# EAGLE design charge controller_mk2 (EAGLE 9.3.2)
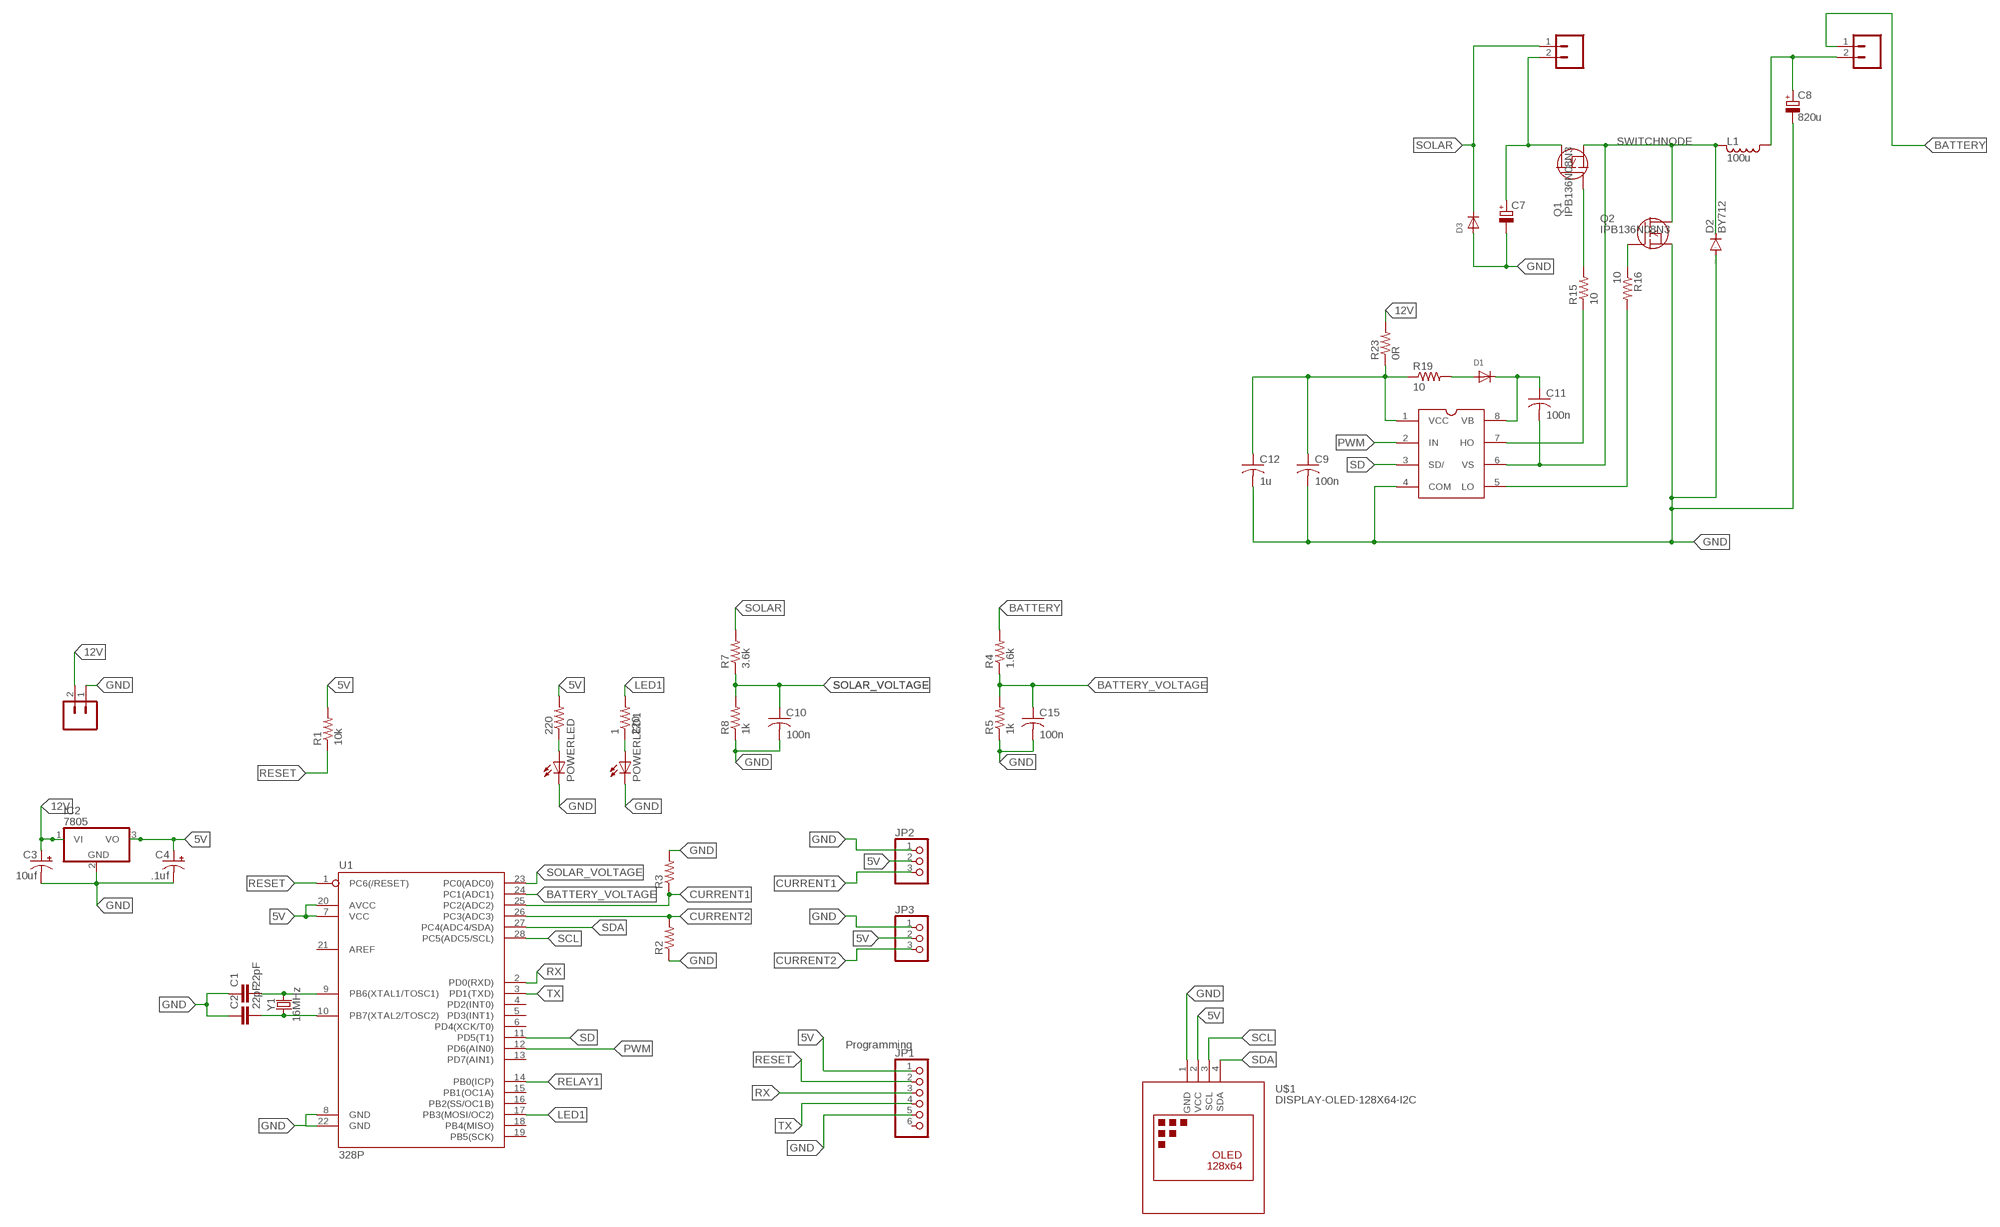
[diagram p0: schematic, sheet 1]

## Parts
1  220  R-US_0204/5  [0204/5]
220  R-US_0204/5  [0204/5]
BATTERY-OUT  CONN_025MM  [SCREWTERMINAL-5MM-2]
C1  22pF  22PF-PTH-2.54MM-200V-5%  [CAP-PTH-2.54]
C2  22pF  22PF-PTH-2.54MM-200V-5%  [CAP-PTH-2.54]
C3  10uf  CPOL-USE5-5  [E5-5]
C4  .1uf  CPOL-USE5-5  [E5-5]
C7  680u  C_POLARIZED10MM  [10MM]
C8  820u  C_POLARIZED10MM  [10MM]
C9  100n  C-US050-025X075  [C050-025X075]
C10  100n  C-US050-025X075  [C050-025X075]
C11  100n  C-US050-055X075  [C050-055X075]
C12  1u  C-US050-025X075  [C050-025X075]
C15  100n  C-US050-025X075  [C050-025X075]
D1  DIODEDO-1N4148  [DO-1N4148]
D2  BY712  [SOD61E]
D3  DIODEDO-1N4148  [DO-1N4148]
IC2  7805  7818TV  [TO220V]
J1  PWR_in  CONN_025MM  [SCREWTERMINAL-5MM-2]
JP1  PINHD-1X6  [1X06]
JP2  PINHD-1X3  [1X03]
JP3  PINHD-1X3  [1X03]
L1  100u  INDUCTORMSS1583  [MSS1583]
POWERLED  LED5MM  [LED5MM]
POWERLED1  LED5MM  [LED5MM]
Q1  IPB136N08N3  IRF840  [TO220]
Q2  IPB136N08N3  IRF840  [TO220]
R1  10k  R-US_0204/5  [0204/5]
R2  R-US_0207/7  [0207/7]
R3  R-US_0207/7  [0207/7]
R4  1.6k  R-US_0207/7  [0207/7]
R5  1k  R-US_0207/7  [0207/7]
R7  3.6k  R-US_0207/7  [0207/7]
R8  1k  R-US_0207/7  [0207/7]
R15  10  R-US_0204/7  [0204/7]
R16  10  R-US_0204/7  [0204/7]
R19  10  R-US_0204/7  [0204/7]
R23  0R  R-US_0204/7  [0204/7]
SOLAR-IN  CONN_025MM  [SCREWTERMINAL-5MM-2]
U1  328P  ATMEGA328P_PDIP  [DIP28]
U$1  DISPLAY-OLED-128X64-I2C  [DISPLAY-OLED-128X64-I2C]
U$2  IR2104  [IR2104]
Y1  16MHz  CRYSTAL-16MHZPTH-HC49US  [HC49US]

## Nets
5V: 220.2 C4.+ IC2.3(VO) JP1.1 JP2.2 JP3.2 R1.2 U1.7(VCC) U1.20(AVCC) U$1.2(VCC)
12V: C3.+ IC2.1(VI) J1.2 R23.2
BATTERY: BATTERY-OUT.1 R4.2
BATTERY_VOLTAGE: C15.1 R4.1 R5.2 U1.24(PC1(ADC1))
CURRENT1: JP2.3 R3.1 U1.25(PC2(ADC2))
CURRENT2: JP3.3 R2.2 U1.26(PC3(ADC3))
GND: C1.1 C2.1 C3.- C4.- C7.- C8.- C9.2 C10.2 C12.2 C15.2 D2.A D3.A IC2.2(GND) J1.1 JP1.5 JP2.1 JP3.1 POWERLED1.K(C) POWERLED.K(C) Q2.3(S) R2.1 R3.2 R5.1 R8.1 U1.8(GND) U1.22(GND) U$1.1(GND) U$2.4(COM)
LED1: 1.2 U1.17(PB3(MOSI/OC2))
N$1: 220.1 POWERLED.A
N$2: C1.2 U1.9(PB6(XTAL1/TOSC1)) Y1.2
N$3: C2.2 U1.10(PB7(XTAL2/TOSC2)) Y1.1
N$4: D1.A R19.2
N$5: 1.1 POWERLED1.A
N$7: BATTERY-OUT.2 C8.+ L1.1
N$8: Q1.1(G) R15.2
N$9: C7.+ Q1.2(D) SOLAR-IN.2
N$11: Q2.1(G) R16.1
N$12: C11.1 D1.C U$2.8(VB)
N$14: R15.1 U$2.7(HO)
N$15: R16.2 U$2.5(LO)
N$19: C9.1 C12.1 R19.1 R23.1 U$2.1(VCC)
PWM: U1.12(PD6(AIN0)) U$2.2(IN)
RELAY1: U1.14(PB0(ICP))
RESET: JP1.2 R1.1 U1.1(PC6(/RESET))
RX: JP1.3 U1.2(PD0(RXD))
SCL: U1.28(PC5(ADC5/SCL)) U$1.3(SCL)
SD: U1.11(PD5(T1)) U$2.3(SD/)
SDA: U1.27(PC4(ADC4/SDA)) U$1.4(SDA)
SOLAR: D3.C R7.2 SOLAR-IN.1
SOLAR_VOLTAGE: C10.1 R7.1 R8.2 U1.23(PC0(ADC0))
SWITCHNODE: C11.2 D2.C L1.2 Q1.3(S) Q2.2(D) U$2.6(VS)
TX: JP1.4 U1.3(PD1(TXD))
Unconnected: JP1.6 U1.4(PD2(INT0)) U1.5(PD3(INT1)) U1.6(PD4(XCK/T0)) U1.13(PD7(AIN1)) U1.15(PB1(OC1A)) U1.16(PB2(SS/OC1B)) U1.18(PB4(MISO)) U1.19(PB5(SCK)) U1.21(AREF)

## Notes on the sheet
- Programming

## Library data of the parts
1 220 R1-R5 R7 R8 R15 R16 R19 R23 = adafruit:R-US_: RESISTOR, American symbol
BATTERY-OUT J1 SOLAR-IN = SparkFun-Retired:CONN_02: Multi connection point. Often used as Generic Header-pin footprint for 0.1 inch spaced/style header connections On any of the 0.1 inch spaced packages, you can populate with these: Break Away Headers - Straight <https://www.sparkfun.com/products/116> (PRT-00116) Break Away Male Headers - Right Angle <https://www.sparkfun.com/products/553> (PRT-00553) Female Headers <https://www.sparkfun.com/products/115> (PRT-00115) Break Away Headers - Machine Pin <https://www.sparkfun.com/products/117> (PRT-00117) Break Away Female Headers - Swiss Machine Pin <https://www.sparkfun.com/products/743> (PRT-00743) For SCREWTERMINALS and SPRING TERMINALS visit here: Screw Terimnals on SparkFun.com <https://www.sparkfun.com/search/results?term=Screw+Terminals> (5mm/3.5mm/2.54mm spacing) This device is also useful as a general connection point to wire up your design to another part of your project. Our various solder wires solder well into these plated through hole pads. Hook-Up Wire - Assortment (Stranded, 22 AWG) <https://www.sparkfun.com/products/11375> (PRT-11375) Hook-Up Wire - Assortment (Solid Core, 22 AWG) <https://www.sparkfun.com/products/11367> (PRT-11367) View the entire wire category on our website here <https://www.sparkfun.com/categories/141> Special notes: Molex polarized connector foot print use with: PRT-08233 with associated crimp pins and housings. 2.54_SCREWTERM for use with PRT-10571. 3.5mm Screw Terminal footprints for PRT-08084 5mm Screw Terminal footprints for use with PRT-08432; SF_SKU: PRT-08432
C1 C2 = SparkFun-Capacitors:22PF: 22pF ceramic capacitors A capacitor is a passive two-terminal electrical component used to store electrical energy temporarily in an electric field.; PROD_ID: CAP-09128
C3 C4 = adafruit:CPOL-US: POLARIZED CAPACITOR, American symbol
C7 C8 = 00Capacitor:C_POLARIZED
C9-C12 C15 = adafruit:C-US: CAPACITOR, American symbol
D1 D3 = adafruit:DIODE: Diode SMADIODE - SMA Surface Mount Package 20V 1A Schottky Diode Digikey: 641-1014-6-ND DO-1N4148 - Through Hole Small Current Diode SOD-123 20V 1 A (.5mV Vf) Schottky Diode - Digikey: MBRX120TPMSCT-ND SOD-323 10V 570mA (.38mV Vf, 3ns) Schottky Diode - Digikey: ZLLS410CT-ND SOD-523 30V 30mA Schottky Diode (RB751S-40TE61) - Digikey: RB751S-40TE61CT-ND SOT23-R/W - SOT23 Package (R = Solder Paste/Reflow Ovens, W = Hand-Soldering) BAT54Film 40V 300mA - Digikey: 497-7162-1-ND
D2 = diode:BY712: DIODE fast high-voltage soft-recovery rectifier
IC2 = linear:78*: Positive VOLTAGE REGULATOR Source: http://cache.national.com/ds/LM/LM78L05.pdf http://www.fairchildsemi.com/ds/LM/LM7805.pdf
JP1 = adafruit:PINHD-1X6: PIN HEADER
JP2 JP3 = adafruit:PINHD-1X3: PIN HEADER
L1 = 00Inductor:INDUCTOR
POWERLED POWERLED1 = adafruit:LED: LED OSRAM: - CHIPLED LG R971, LG N971, LY N971, LG Q971, LY Q971, LO R971, LY R971 LH N974, LH R974 LS Q976, LO Q976, LY Q976 LO Q996 - Hyper CHIPLED LW Q18S LB Q993, LB Q99A, LB R99A - SideLED LS A670, LO A670, LY A670, LG A670, LP A670 LB A673, LV A673, LT A673, LW A673 LH A674 LY A675 LS A676, LA A676, LO A676, LY A676, LW A676 LS A679, LY A679, LG A679 - Hyper Micro SIDELED® LS Y876, LA Y876, LO Y876, LY Y876 LT Y87S - SmartLED LW L88C, LW L88S LB L89C, LB L89S, LG L890 LS L89K, LO L89K, LY L89K LS L896, LA L896, LO L896, LY L896 - TOPLED LS T670, LO T670, LY T670, LG T670, LP T670 LSG T670, LSP T670, LSY T670, LOP T670, LYG T670 LG T671, LOG T671, LSG T671 LB T673, LV T673, LT T673, LW T673 LH T674 LS T676, LA T676, LO T676, LY T676, LB T676, LH T676, LSB T676, LW T676 LB T67C, LV T67C, LT T67C, LS T67K, LO T67K, LY T67K, LW E67C LS E67B, LA E67B, LO E67B, LY E67B, LB E67C, LV E67C, LT E67C LW T67C LS T679, LY T679, LG T679 LS T770, LO T770, LY T770, LG T770, LP T770 LB T773, LV T773, LT T773, LW T773 LH T774 LS E675, LA E675, LY E675, LS T675 LS T776, LA T776, LO T776, LY T776, LB T776 LHGB T686 LT T68C, LB T68C - Hyper Mini TOPLED® LB M676 - Mini TOPLED Santana® LG M470 LS M47K, LO M47K, LY M47K Source: http://www.osram.convergy.de/
Q1 Q2 = tango:IRF840: N-Channel Enhancement MOSFET (HEXFET); 500V; 8A; 0,85Ohm
U1 = SparkFun-IC-Microcontroller:ATMEGA328P_PDIP: Atmel 328P Through hole ATMEGA328P uC used in the Arduino 32kb flash, 1k EEPROM, 2k SRAM Datasheet <http://www.sparkfun.com/datasheets/Components/SMD/ATMega328.pdf> SparkFun Products Storefront component: AVR 28 Pin 20MHz 32K 6A/D - ATMega328P <https://www.sparkfun.com/products/9061> (COM-09061) SparkFun Simon Says - Through-Hole Soldering Kit <https://www.sparkfun.com/products/10547> (KIT-10547) SparkFun Learn to Solder - Simon Says <https://www.sparkfun.com/products/13708> (KIT-13708) SparkFun BigTime Watch Kit <https://www.sparkfun.com/products/11734> (KIT-11734) SparkFun ClockIt <https://www.sparkfun.com/products/10930> (KIT-10930) SparkFun Serial Enabled LCD Kit <https://www.sparkfun.com/products/10097> (LCD-10097) SparkFun Simon Tilts - Through Hole Soldering Kit <https://www.sparkfun.com/products/12634> (KIT-12634) SparkFun Frequency Counter Kit <https://www.sparkfun.com/products/10140> (KIT-10140) FabFM Radio Kit <https://www.sparkfun.com/products/11043> (KIT-11043) SparkFun Binary Blaster Kit <https://www.sparkfun.com/products/12037> (KIT-12037) SparkFun Metro-Gnome <https://www.sparkfun.com/products/9236> (KIT-09236) ATmega328 with Arduino Optiboot (Uno) <https://www.sparkfun.com/products/10524> (DEV-10524); PROD_ID: IC-09136
U$1 = diy-modules:DISPLAY-OLED-128X64-I2C: 128x64 Dot Matrix OLED Module based on SSD1306 chip Variant with I2C interface More details available here: http://www.instructables.com/id/Monochrome-096-i2c-OLED-display-with-arduino-SSD13/ SSD1306 datasheet: https://cdn-shop.adafruit.com/datasheets/SSD1306.pdf Click here to find device on ebay.com <http://www.ebay.com/sch/oled+display+128x64+iic> Note: There are two variants: I2C and SPI. Search for the proper version.
U$2 = ir-2104:IR2104: Half Bridge mosfet - IGBT driver
Y1 = SparkFun-Clocks:CRYSTAL-16MHZ: 16MHz Crystal Digikey Example <http://www.digikey.com/product-search/en?keywords=535-9122-1-ND> Frequency: 16MHz Frequency Stability: ±50ppm Frequency Tolerance: ±20ppm Load Capacitance: 18pF SparkFun Products: Pro Micro -5V/16MHz <https://www.sparkfun.com/products/12640> SparkFun Serial Enabled LCD Kit <https://www.sparkfun.com/products/10097>; PROD_ID: XTAL-08181; SF_ID: COM-00536

## Board
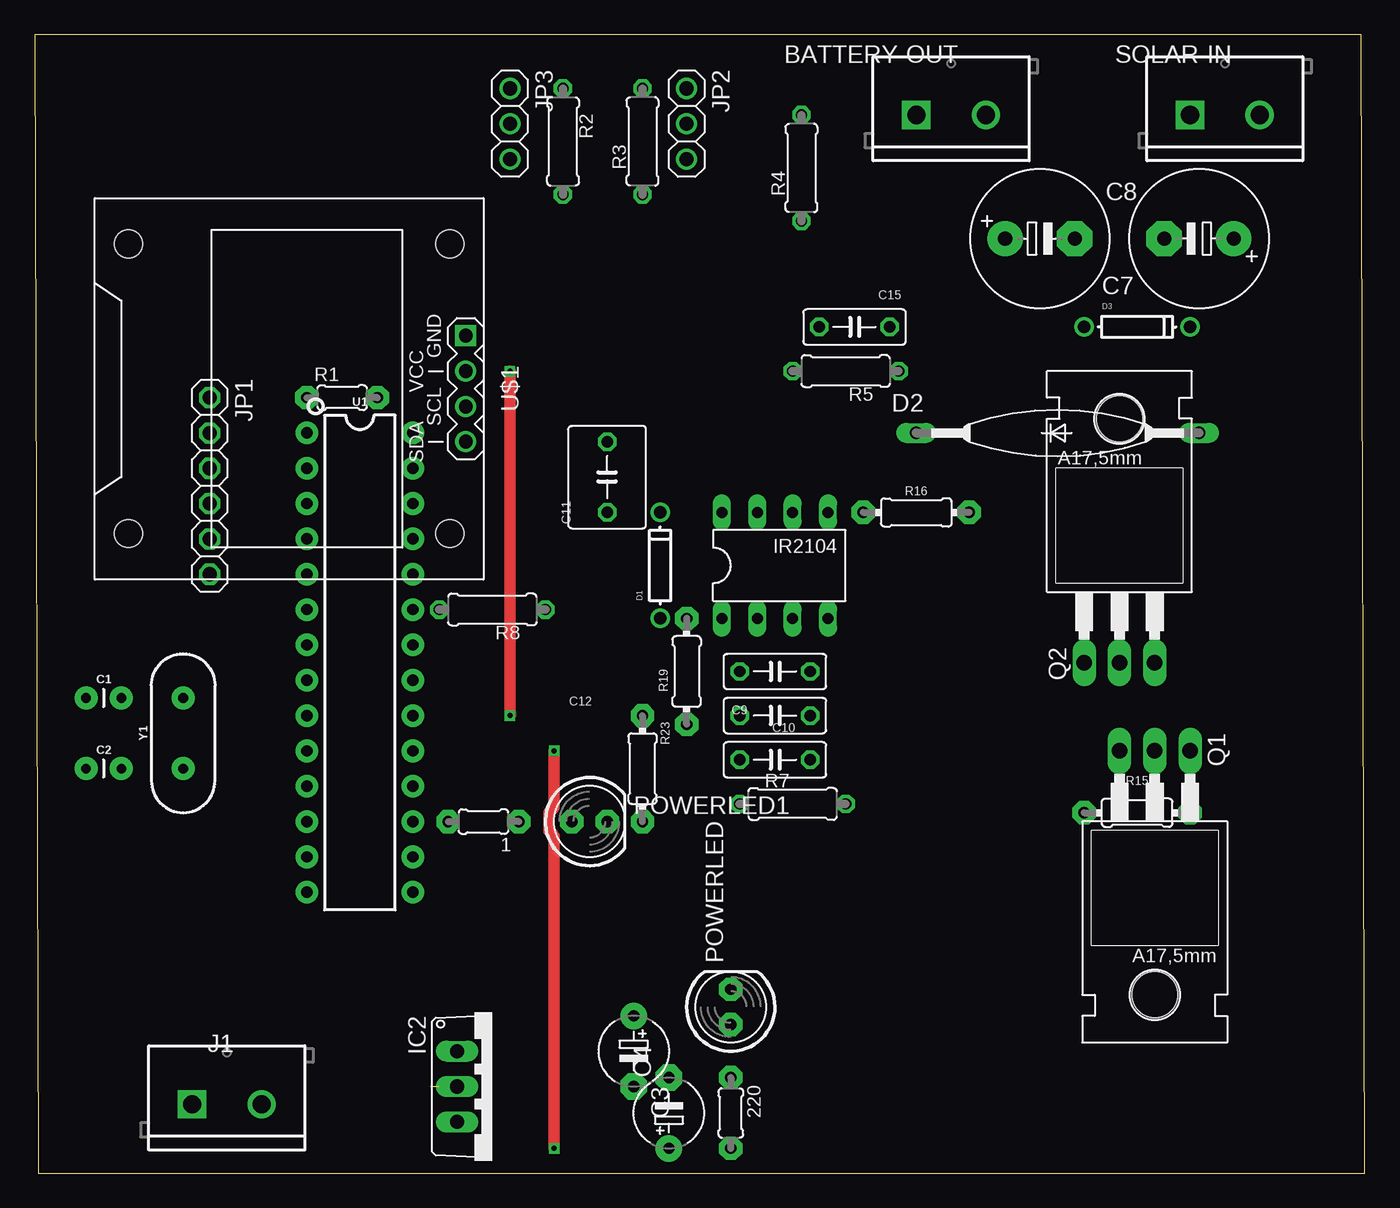
[diagram p1: board, top side]
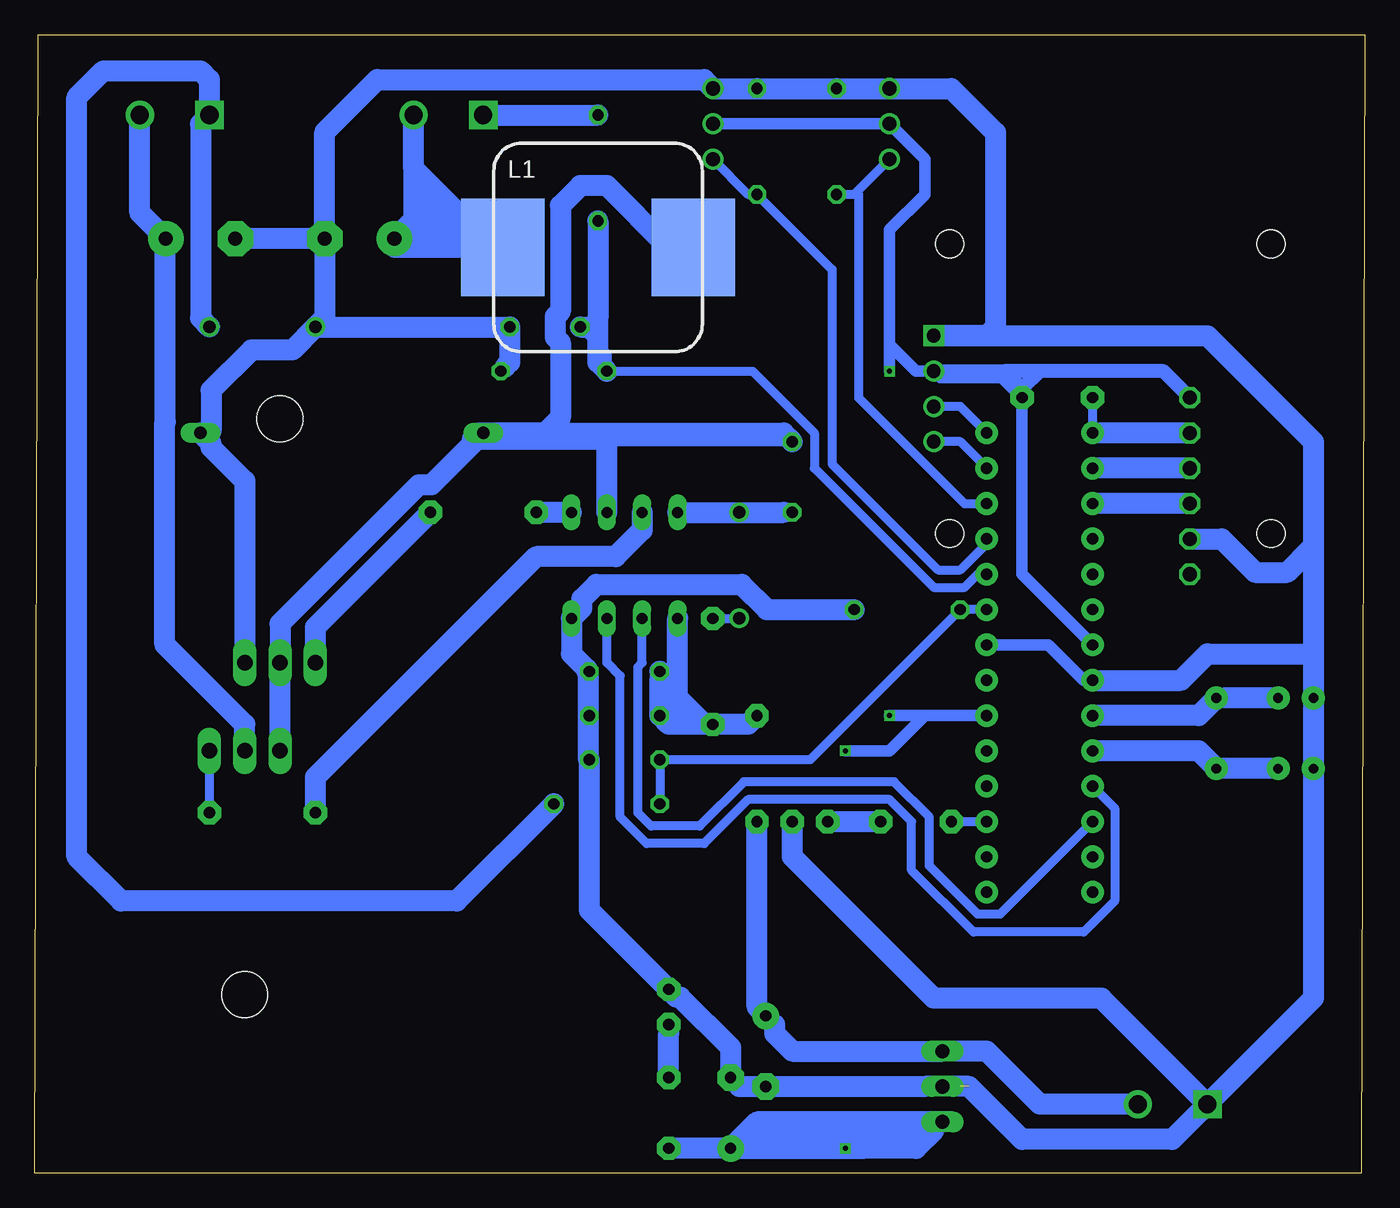
[diagram p2: board, bottom side, seen from below]

Size 95.61 x 81.84 mm. Coordinates in mm from the lower left corner, seen from the top.
Outline: 0.25,0 95.61,0 95.36,81.84 0,81.84 0.25,0
Copper layers (1*16): Top 0.035mm / dielectric 1.5mm / Bottom 0.035mm
Design rules "default *": minimum track width 25mil, minimum drill 0.35mm, track to track 15mil, track to pad 15mil, pad to pad 15mil, via to via 6mil, smd to smd 6mil, copper to edge 40mil, drill to drill 6mil, minimum pad ring 10mil, minimum via ring 8mil, stop-mask expansion 4mil, vias tented up to drill 0mil, thermal gap 10mil

### Footprints (pad centres in the part's own frame; a part is rotated, then mirrored left to right if it is on the bottom)
0204/5 = drill 0.813 pad 1.676 octagon: 1 -2.54,0; 2 2.54,0
SCREWTERMINAL-5MM-2 = drill 1.3 pad 2.032 square: 1 0,0 | drill 1.3 pad 2.032: 2 5,0
CAP-PTH-2.54 = drill 0.7 pad 1.651: 1 -1.27,0; 2 1.27,0
E5-5 = drill 0.813 pad 1.905: + -2.54,0 | drill 0.813 pad 1.905 octagon: - 2.54,0
10MM = drill 1.016 pad 2.54: + -2.5,0 | drill 1.016 pad 2.54 octagon: - 2.5,0
C050-025X075 = drill 0.813 octagon: 1 -2.54,0; 2 2.54,0
C050-055X075 = drill 0.813 octagon: 1 -2.54,0; 2 2.54,0
DO-1N4148 = drill 0.9: A -3.81,0; C 3.81,0
SOD61E = drill 0.914 long: A 10.16,0; C -10.16,0
TO220V = drill 1.016 long: 1 -2.54,-2.54; 2 0,-2.54; 3 2.54,-2.54
1X06 = drill 1.016 octagon: 1 -6.35,0; 2 -3.81,0; 3 -1.27,0; 4 1.27,0; 5 3.81,0; 6 6.35,0
1X03 = drill 1.016: 1 -2.54,0; 2 0,0; 3 2.54,0
MSS1583 = smd 6 x 7: 1 -6.85,0; 2 6.85,0
LED5MM = drill 0.813 pad 1.676 octagon: A -1.27,0; K 1.27,0
TO220 = drill 1.118 long: 1 -2.54,-6.35; 2 0,-6.35; 3 2.54,-6.35 | hole 3.302: 0,11.176
0207/7 = drill 0.813 octagon: 1 -3.81,0; 2 3.81,0
0204/7 = drill 0.813 pad 1.676 octagon: 1 -3.81,0; 2 3.81,0
DIP28 = drill 0.813 pad 1.626: 1 -16.51,-3.81; 2 -13.97,-3.81; 3 -11.43,-3.81; 4 -8.89,-3.81; 5 -6.35,-3.81; 6 -3.81,-3.81; 7 -1.27,-3.81; 8 1.27,-3.81; 9 3.81,-3.81; 10 6.35,-3.81; 11 8.89,-3.81; 12 11.43,-3.81; 13 13.97,-3.81; 14 16.51,-3.81; 15 16.51,3.81; 16 13.97,3.81; 17 11.43,3.81; 18 8.89,3.81; 19 6.35,3.81; 20 3.81,3.81; 21 1.27,3.81; 22 -1.27,3.81; 23 -3.81,3.81; 24 -6.35,3.81; 25 -8.89,3.81; 26 -11.43,3.81; 27 -13.97,3.81; 28 -16.51,3.81
DISPLAY-OLED-128X64-I2C = drill 1 square: 1 -3.81,12.7 | drill 1: 2 -1.27,12.7; 3 1.27,12.7; 4 3.81,12.7 | hole 2: -10.414,11.557; 10.414,11.557; 10.414,-11.557; -10.414,-11.557
IR2104 = drill 0.8 long: 1 -1.905,8.89; 2 -1.905,6.35; 3 -1.905,3.81; 4 -1.905,1.27; 5 5.715,1.27; 6 5.715,3.81; 7 5.715,6.35; 8 5.715,8.89
HC49US = drill 0.7 pad 1.651: 1 -2.54,0; 2 2.54,0

### Placement (x,y rotation side)
1  32.26,25.27 180 top
220  50.04,4.32 270 top
BATTERY-OUT  63.37,76.07 0 top
C1  4.95,34.16 0 top
C2  4.95,29.08 0 top
C3  43.05,8.76 270 top
C4  45.59,4.32 90 top
C7  83.69,67.18 180 top
C8  72.26,67.18 0 top
C9  53.21,32.89 0 top
C10  53.21,29.72 0 top
C11  41.15,50.04 90 top
C12  53.21,36.07 0 top
C15  58.93,60.83 0 top
D1  44.96,43.69 90 top
D2  73.53,53.21 0 top
D3  79.25,60.83 0 top
IC2  32.89,6.22 270 top
J1  11.3,4.95 0 top
JP1  12.57,49.4 270 top
JP2  46.86,75.44 270 top
JP3  34.16,75.44 270 top
L1  55.12,66.55 0 bottom
POWERLED  50.04,11.94 90 top
POWERLED1  39.88,25.27 0 top
Q1  80.52,24 180 top
Q2  77.98,43.05 0 top
R1  22.1,55.75 0 top
R2  37.97,74.17 270 top
R3  43.69,74.17 90 top
R4  55.12,72.26 90 top
R5  58.29,57.66 180 top
R7  54.48,26.54 0 top
R8  32.89,40.51 180 top
R15  79.25,25.91 0 top
R16  63.37,47.5 180 top
R19  46.86,36.07 90 top
R23  43.69,29.08 270 top
SOLAR-IN  83.06,76.07 0 top
U1  23.37,36.7 270 top
U$1  18.29,56.39 270 top
U$2  58.29,41.78 90 top
Y1  10.67,31.62 90 top

### Tracks (layer width: path | path; a pad name or v marks a point on that pad's centre or on a via)
5V  (via drill 0.35)
  Top 0.813: v37.34,1.78 37.34,24.24 36.98,24.6 36.98,25.95 37.34,26.3 v37.34,30.35 | v34.16,32.89 v34.16,57.66
  Bottom 0.635: 25.91,57.34 26.07,57.18 | 21.14,39.56 U1.7
  Bottom 0.813: JP2.2 JP3.2 31.62,72.9 31.62,70.36 34.16,67.82 34.16,59.56 | 34.16,59.56 32.26,57.66 U$1.2 30.51,57.18 26.07,57.18 R1.2 | R1.2 24.64,56.39 | R1.2 24.64,43.05 U1.7 | 37.34,3.68 37.34,3.05 | v37.34,30.35 34.16,30.35 31.62,32.89 | 31.62,32.89 U1.20 | 31.62,32.89 v34.16,32.89 | v34.16,57.66 34.16,59.56 | IC2.3 30.99,3.05 32.26,3.05 34.8,3.05 36.07,3.05 37.34,3.05 | 36.7,3.68 37.34,3.05 | 37.34,3.05 v37.34,1.78 36.39,2.73 | 38.61,3.05 39.24,3.05
  Bottom 1.016: U$1.2 25.91,57.66 | 25.91,57.66 24.64,56.39 23.37,57.66 | JP1.1 14.48,57.66 23.37,57.66 | 23.37,57.66 25.91,57.66
  Bottom 1.524: 44.32,3.05 43.69,3.68 37.34,3.68 36.7,3.68 IC2.3 34.16,3.68 34.8,3.05 | 44.32,3.05 C4.+ | C4.+ 220.2 | v37.34,1.78 38.61,3.05 44.32,3.05 | C4.+ 36.07,1.78 | 30.99,3.05 32.26,1.78 36.07,1.78 | 36.07,1.78 36.07,3.05 36.39,2.73 | 36.07,1.78 35.43,2.41 32.89,2.41 32.26,3.05
12V
  Bottom 1.524: J1.2 23.37,4.95 27.18,8.76 IC2.1 41.15,8.76 42.42,10.03 42.42,10.67 C3.+ 43.69,11.94 R23.2
BATTERY
  Bottom 1.524: BATTERY-OUT.1 R4.2
BATTERY_VOLTAGE
  Bottom 0.635: C15.1 55.28,59.72 | 55.28,59.72 54.48,58.93 R5.2 44,57.66 39.56,53.21 39.56,50.67 30.99,42.1 28.77,42.1 27.81,43.05 U1.24 | 55.12,60.83 55.12,59.88 55.28,59.72
  Bottom 1.524: R4.1 55.12,61.47 55.12,60.83 | R5.2 55.12,58.29 55.12,60.83 | C15.1 55.12,60.83
CURRENT1
  Bottom 0.635: JP2.3 44.32,70.36 R3.1 38.29,64.96 38.29,50.99 30.67,43.37 29.08,43.37 27.18,45.28 U1.25
CURRENT2
  Bottom 0.635: R2.2 36.7,70.36 36.54,70.52 | JP3.3 36.54,70.52 | U1.26 28.77,48.13 36.39,55.75 36.39,70.36 36.54,70.52
GND  (1 unrouted)
  Bottom 0.635: 31.62,6.22 C3.- 44.96,6.22 | C10.2 C9.2 C12.2 57.02,37.34 | 43.37,40.51 R8.1 | 61.78,57.98 R5.1 | 75.44,66.55 74.8,67.18 C8.- 74.49,67.18 | 14.79,60.2 15.11,60.2 | 15.75,60.2 27.18,60.2 | 29.08,6.22 IC2.2
  Bottom 0.813: U1.22 22.73,37.97 20.19,35.43 U1.8
  Bottom 1.524: C8.- C7.- | D3.A C15.2 61.47,58.29 61.78,57.98 | C8.- 74.76,61.51 D3.A | D3.A 77.09,59.18 80.03,59.18 82.93,56.28 82.93,53.34 83.06,53.21 D2.A 82.93,52.45 82.93,52.18 80.52,49.76 Q2.3 | R8.1 42.98,40.51 44.8,42.33 55.23,42.33 56.28,41.28 56.28,40.62 U$2.4 57.02,37.34 55.94,36.26 55.94,36.1 55.83,35.99 55.83,29.8 C10.2 55.75,18.92 POWERLED.K 49.48,12.65 49.22,12.65 45.59,9.03 C4.- 44.96,6.22 31.62,6.22 28.45,6.22 24.64,2.41 13.84,2.41 J1.1 | J1.1 3.68,12.57 C2.1 C1.1 3.68,37.34 | J1.1 18.92,12.57 30.99,12.57 41.15,22.73 POWERLED1.K | C8.- 74.76,74.84 70.99,78.61 47.5,78.61 JP2.1 R3.2 R2.1 JP3.1 29.72,77.98 26.54,74.8 26.54,60.83 27.18,60.2 U$1.1 15.75,60.2 15.11,60.2 11.3,60.2 3.68,52.58 3.68,44.96 | 3.68,44.96 3.68,37.34 | 3.68,37.34 11.3,37.34 13.21,35.43 U1.8 | JP1.5 10.28,45.59 7.88,43.2 5.58,43.2 3.82,44.96 3.68,44.96
LED1
  Bottom 0.635: 1.2 U1.17
N$1
  Bottom 0.635: 50.04,10.03 POWERLED.A
  Bottom 1.524: 220.1 50.04,10.03
N$2
  Bottom 0.635: 10.03,34.16 Y1.2
  Bottom 1.524: C1.2 10.03,34.16 | Y1.2 11.94,32.89 U1.9
N$3
  Bottom 1.524: C2.2 Y1.1 11.94,30.35 U1.10
N$4
  Bottom 0.635: R19.2 D1.A
N$5
  Bottom 1.524: POWERLED1.A 1.1
N$7
  Bottom 0.635: 68.45,72.9 68.45,68.45 69.72,67.18 C8.+ | 68.45,72.9 68.45,76.07 BATTERY-OUT.2 | 68.45,72.9 62.1,66.55 L1.1
  Bottom 1.524: 68.37,72.18 68.37,68.53 69.72,67.18 | 68.37,72.18 BATTERY-OUT.2 | C8.+ 65.91,67.18 64.96,68.14 | 68.37,72.18 66.87,70.68 67.18,70.36 67.18,67.82 66.55,68.45 66.55,70.36 64.96,68.77 64.96,68.14 | 64.96,68.14 65.6,68.14 65.91,67.82 64.01,67.82 63.37,67.18 | L1.1 69.72,66.55
N$8
  Bottom 0.635: Q1.1 R15.2
N$9
  Bottom 0.635: 85.91,67.18 C7.+ 86.23,67.18
  Bottom 1.524: Q1.2 80.52,32.26 86.26,38 86.26,53.98 86.23,54.01 86.23,67.18 | C7.+ 88.06,69.05 SOLAR-IN.2
N$11
  Bottom 1.524: R16.1 75.44,39.24 Q2.1
N$12
  Bottom 0.635: U$2.8 D1.C 41.78,47.5 C11.1
  Bottom 1.524: U$2.8 41.78,47.5
N$14
  Bottom 1.524: U$2.7 51.94,46.23 53.85,44.32 59.56,44.32 75.44,28.45 R15.1
N$15
  Bottom 1.524: U$2.5 R16.2
N$19
  Bottom 0.635: C9.1 C12.1 50.36,35.75 R19.1
  Bottom 1.524: R23.1 44.32,32.26 R19.1 50.04,32.26 C9.1 50.67,35.43 | 50.67,35.43 50.36,35.75 | C12.1 50.67,35.43 | 50.67,35.43 48.13,32.89 49.4,32.89 50.04,33.53 49.4,34.16 U$2.1
PWM
  Bottom 0.635: U$2.2 51.94,36.7 52.26,36.39 52.26,25.91 51.31,24.96 47.82,24.96 44.64,28.13 33.84,28.13 31.3,25.59 31.3,22.1 27.81,18.61 26.23,18.61 U1.12
RESET
  Bottom 0.635: U1.1 R1.1
  Bottom 1.524: JP1.2 U1.1
RX
  Bottom 1.524: JP1.3 U1.2
SCL
  Bottom 0.635: U$1.3 29.08,55.12 U1.28
SD
  Bottom 0.635: U$2.3 54.48,36.7 53.53,35.75 53.53,25.59 51.63,23.69 47.5,23.69 44.32,26.86 34.16,26.86 32.58,25.27 32.58,21.78 28.13,17.34 20.19,17.34 17.97,19.56 17.97,26.23 U1.11
SDA
  Bottom 0.635: U$1.4 29.08,52.58 U1.27
SOLAR
  Bottom 1.524: D3.C 83.69,61.47 83.69,75.44 SOLAR-IN.1 83.06,78.61 83.69,79.25 90.68,79.25 92.58,77.34 92.58,22.73 89.41,19.56 65.28,19.56 R7.2
SOLAR_VOLTAGE
  Bottom 0.635: R7.1 C10.1 39.88,29.72 R8.2 U1.23
SWITCHNODE
  Bottom 0.635: 59.88,53.21 D2.C 63.69,53.21 64.17,52.74 77.98,38.92 Q2.2 | 58.93,52.58 57.98,52.58 | 57.98,52.58 54.48,52.58 C11.2 | 57.98,52.58 57.98,67.18
  Bottom 1.524: Q1.3 Q2.2 77.98,39.5 68,49.48 67.11,49.48 D2.C | L1.2 50.04,66.55 54.48,70.99 56.39,70.99 57.82,69.56 57.82,61.95 58.19,61.58 58.19,60.09 57.82,59.72 57.82,54.32 58.93,53.21 | 58.93,53.21 63.69,53.21 | 58.93,53.21 41.78,53.21 C11.2 | U$2.6 54.48,52.58 54.64,52.74 64.17,52.74
TX
  Bottom 1.524: JP1.4 U1.3